# EAGLE schematic adc (EAGLE 6.1)
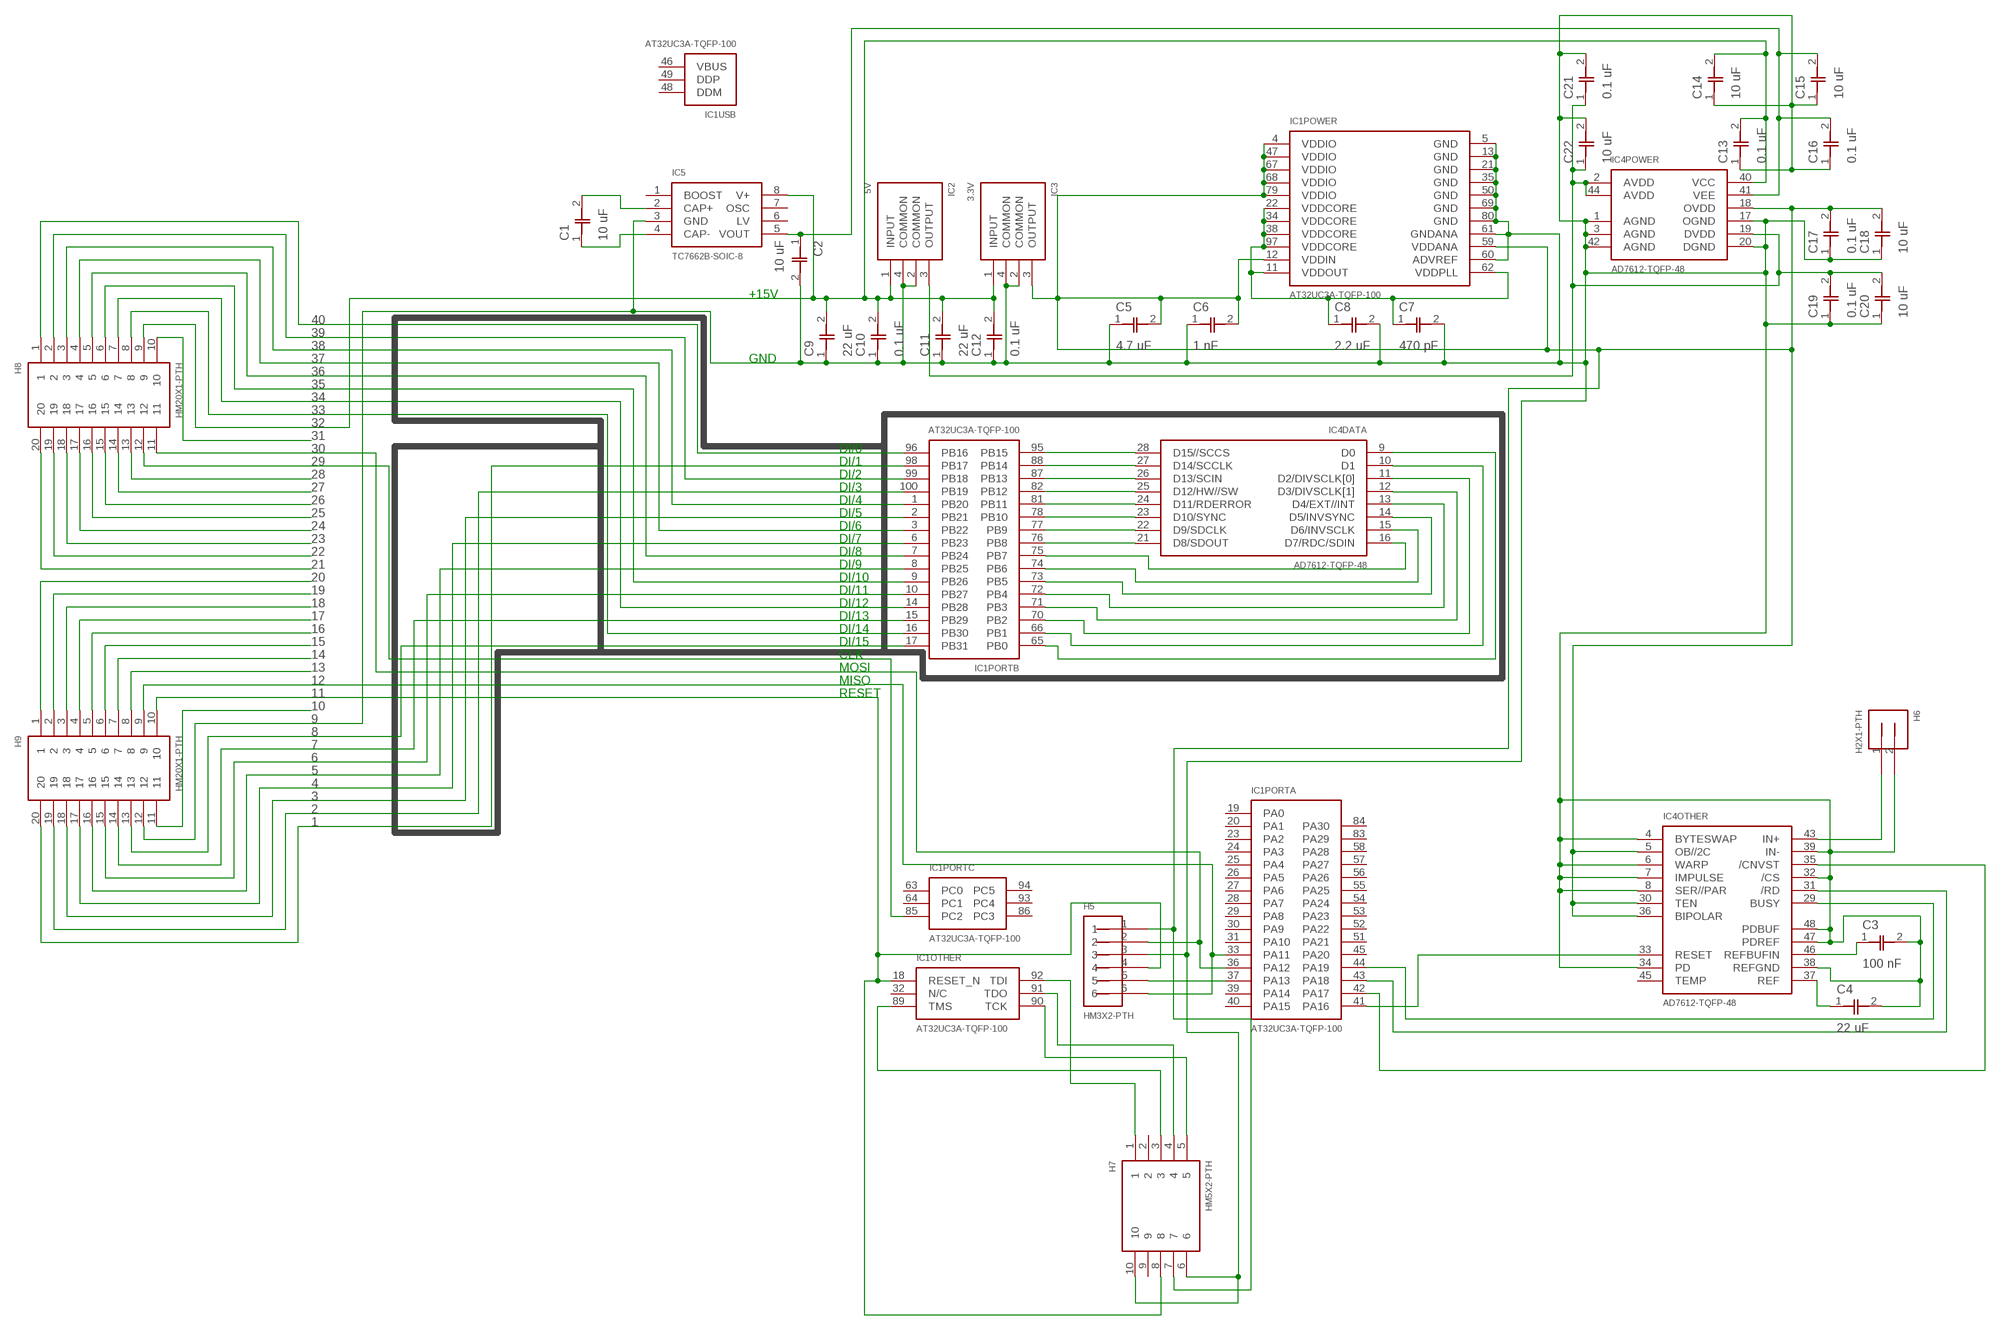
[diagram p0: schematic, sheet 1]

## Parts
C1  10 uF  CAP-0805  [CAP-0805]
C2  10 uF  CAP-0805  [CAP-0805]
C3  100 nF  CAP-0603  [CAP-0603]
C4  22 uF  CAP-0805  [CAP-0805]
C5  4.7 uF  CAP-0603  [CAP-0603]
C6  1 nF  CAP-0603  [CAP-0603]
C7  470 pF  CAP-0603  [CAP-0603]
C8  2.2 uF  CAP-0603  [CAP-0603]
C9  22 uF  CAP-0805  [CAP-0805]
C10  0.1 uF  CAP-0603  [CAP-0603]
C11  22 uF  CAP-0805  [CAP-0805]
C12  0.1 uF  CAP-0603  [CAP-0603]
C13  0.1 uF  CAP-0603  [CAP-0603]
C14  10 uF  CAP-0805  [CAP-0805]
C15  10 uF  CAP-0805  [CAP-0805]
C16  0.1 uF  CAP-0603  [CAP-0603]
C17  0.1 uF  CAP-0603  [CAP-0603]
C18  10 uF  CAP-0603  [CAP-0603]
C19  0.1 uF  CAP-0603  [CAP-0603]
C20  10 uF  CAP-0603  [CAP-0603]
C21  0.1 uF  CAP-0603  [CAP-0603]
C22  10 uF  CAP-0603  [CAP-0603]
H5  HM3X2-PTH  [HM3X2-PTH]
H6  H2X1-PTH  [HM2X1-PTH]
H7  HM5X2-PTH  [HM5X2-PTH]
H8  HM20X1-PTH  [HM20X1-PTH]
H9  HM20X1-PTH  [HM20X1-PTH]
IC1  AT32UC3A-TQFP-100  [TQFP-100]
IC2  5V  UA78M-SOT-223-4  [SOT-223-4]
IC3  3.3V  UA78M-SOT-223-4  [SOT-223-4]
IC4  AD7612-TQFP-48  [LQFP-48]
IC5  TC7662B-SOIC-8  [SOIC-8]

## Nets
1: H9.20 IC1.98(PORTB:PB17)
1.8V: C7.1 C8.1 IC1.11(POWER:VDDOUT) IC1.22(POWER:VDDCORE) IC1.34(POWER:VDDCORE) IC1.38(POWER:VDDCORE) IC1.62(POWER:VDDPLL) IC1.97(POWER:VDDCORE)
2: H9.19 IC1.100(PORTB:PB19)
3: H9.18 IC1.2(PORTB:PB21)
3.3V: C5.2 C6.2 C17.2 C18.2 H5.1 H7.7 IC1.4(POWER:VDDIO) IC1.12(POWER:VDDIN) IC1.47(POWER:VDDIO) IC1.59(POWER:VDDANA) IC1.67(POWER:VDDIO) IC1.68(POWER:VDDIO) IC1.79(POWER:VDDIO) IC3.3(OUTPUT) IC4.5(OTHER:OB//2C) IC4.18(POWER:OVDD) IC4.30(OTHER:TEN) IC4.36(OTHER:BIPOLAR)
4: H9.17 IC1.6(PORTB:PB23)
5: H9.16 IC1.8(PORTB:PB25)
5V: C19.2 C20.2 C21.1 C22.1 IC2.3(OUTPUT) IC4.2(POWER:AVDD) IC4.19(POWER:DVDD) IC4.44(POWER:AVDD)
6: H9.15 IC1.10(PORTB:PB27)
7: H9.14 IC1.15(PORTB:PB29)
8: H9.13 IC1.17(PORTB:PB31)
9: C2.2 C3.2 C4.2 C5.1 C6.1 C7.2 C8.2 C9.1 C10.1 C11.1 C12.1 C13.1 C14.1 C15.1 C16.1 C17.1 C18.1 C19.1 C20.1 C21.2 C22.2 H5.3 H6.2 H7.6 H7.10 H9.12 IC1.5(POWER:GND) IC1.13(POWER:GND) IC1.21(POWER:GND) IC1.35(POWER:GND) IC1.50(POWER:GND) IC1.60(POWER:ADVREF) IC1.61(POWER:GNDANA) IC1.69(POWER:GND) IC1.80(POWER:GND) IC2.2(COMMON) IC2.4(COMMON) IC3.2(COMMON) IC3.4(COMMON) IC4.1(POWER:AGND) IC4.3(POWER:AGND) IC4.4(OTHER:BYTESWAP) IC4.6(OTHER:WARP) IC4.7(OTHER:IMPULSE) IC4.8(OTHER:SER//PAR) IC4.17(POWER:OGND) IC4.20(POWER:DGND) IC4.32(OTHER:/CS) IC4.34(OTHER:PD) IC4.38(OTHER:REFGND) IC4.39(OTHER:IN-) IC4.42(POWER:AGND) IC4.47(OTHER:PDREF) IC4.48(OTHER:PDBUF) IC5.3(GND)
10: H9.11
11: H5.4 H7.8 H9.10 IC1.18(OTHER:RESET_N)
12: H5.6 H9.9 IC1.33(PORTA:PA11)
13: H9.8
14: H9.7
15: H9.6
16: H9.5
17: H9.4
18: H9.3
19: H9.2
20: H9.1
21: H8.20
22: H8.19
23: H8.18
24: H8.17
25: H8.16
26: H8.15
27: H8.14
28: H8.13
29: H8.12 IC1.85(PORTC:PC2)
30: H5.2 H8.11 IC1.36(PORTA:PA12)
31: H8.10
32: C9.2 C10.2 C11.2 C12.2 C13.2 C14.2 H8.9 IC2.1(INPUT) IC3.1(INPUT) IC4.40(POWER:VCC) IC5.8(V+)
33: H8.8 IC1.16(PORTB:PB30)
34: H8.7 IC1.14(PORTB:PB28)
35: H8.6 IC1.9(PORTB:PB26)
36: H8.5 IC1.7(PORTB:PB24)
37: H8.4 IC1.3(PORTB:PB22)
38: H8.3 IC1.1(PORTB:PB20)
39: H8.2 IC1.99(PORTB:PB18)
40: H8.1 IC1.96(PORTB:PB16)
-15V: C2.1 C15.2 C16.2 IC4.41(POWER:VEE) IC5.5(VOUT)
N$1: H5.5 IC1.37(PORTA:PA13)
N$2: C1.2 IC5.2(CAP+)
N$4: IC1.65(PORTB:PB0) IC4.9(DATA:D0)
N$5: IC1.66(PORTB:PB1) IC4.10(DATA:D1)
N$6: IC1.70(PORTB:PB2) IC4.11(DATA:D2/DIVSCLK[0])
N$7: IC1.71(PORTB:PB3) IC4.12(DATA:D3/DIVSCLK[1])
N$8: C1.1 IC5.4(CAP-)
N$9: IC1.72(PORTB:PB4) IC4.13(DATA:D4/EXT//INT)
N$10: IC1.73(PORTB:PB5) IC4.14(DATA:D5/INVSYNC)
N$11: IC1.74(PORTB:PB6) IC4.15(DATA:D6/INVSCLK)
N$12: IC1.76(PORTB:PB8) IC4.21(DATA:D8/SDOUT)
N$13: IC1.77(PORTB:PB9) IC4.22(DATA:D9/SDCLK)
N$14: IC1.78(PORTB:PB10) IC4.23(DATA:D10/SYNC)
N$15: IC1.81(PORTB:PB11) IC4.24(DATA:D11/RDERROR)
N$16: IC1.82(PORTB:PB12) IC4.25(DATA:D12/HW//SW)
N$17: IC1.87(PORTB:PB13) IC4.26(DATA:D13/SCIN)
N$18: IC1.88(PORTB:PB14) IC4.27(DATA:D14/SCCLK)
N$19: IC1.95(PORTB:PB15) IC4.28(DATA:D15//SCCS)
N$20: IC1.75(PORTB:PB7) IC4.16(DATA:D7/RDC/SDIN)
N$22: IC1.41(PORTA:PA16) IC4.33(OTHER:RESET)
N$23: IC1.44(PORTA:PA19) IC4.29(OTHER:BUSY)
N$24: IC1.42(PORTA:PA17) IC4.35(OTHER:/CNVST)
N$25: C3.1 IC4.46(OTHER:REFBUFIN)
N$26: C4.1 IC4.37(OTHER:REF)
N$27: IC1.43(PORTA:PA18) IC4.31(OTHER:/RD)
N$28: H6.1 IC4.43(OTHER:IN+)
N$29: H7.5 IC1.90(OTHER:TCK)
N$30: H7.4 IC1.91(OTHER:TDO)
N$31: H7.3 IC1.89(OTHER:TMS)
N$32: H7.1 IC1.92(OTHER:TDI)
Unconnected: H7.2 H7.9 IC1.19(PORTA:PA0) IC1.20(PORTA:PA1) IC1.23(PORTA:PA2) IC1.24(PORTA:PA3) IC1.25(PORTA:PA4) IC1.26(PORTA:PA5) IC1.27(PORTA:PA6) IC1.28(PORTA:PA7) IC1.29(PORTA:PA8) IC1.30(PORTA:PA9) IC1.31(PORTA:PA10) IC1.32(OTHER:N/C) IC1.39(PORTA:PA14) IC1.40(PORTA:PA15) IC1.45(PORTA:PA20) IC1.46(USB:VBUS) IC1.48(USB:DDM) IC1.49(USB:DDP) IC1.51(PORTA:PA21) IC1.52(PORTA:PA22) IC1.53(PORTA:PA23) IC1.54(PORTA:PA24) IC1.55(PORTA:PA25) IC1.56(PORTA:PA26) IC1.57(PORTA:PA27) IC1.58(PORTA:PA28) IC1.63(PORTC:PC0) IC1.64(PORTC:PC1) IC1.83(PORTA:PA29) IC1.84(PORTA:PA30) IC1.86(PORTC:PC3) IC1.93(PORTC:PC4) IC1.94(PORTC:PC5) IC4.45(OTHER:TEMP) IC5.1(BOOST) IC5.6(LV) IC5.7(OSC)

## Notes on the sheet
- +15V
- GND
- DI/0
- DI/1
- DI/2
- DI/3
- DI/4
- DI/5
- DI/6
- DI/7
- DI/8
- DI/9
- DI/10
- DI/11
- DI/12
- DI/13
- DI/14
- DI/15
- CLK
- MOSI
- MISO
- RESET

## Library data of the parts
C1 C2 C4 C9 C11 C14 C15 = august24:CAP
C3 C5-C8 C10 C12 C13 C16-C22 = july13b:CAP
H5 = august24:HM3X2
H6 = august24:H2X1
H7 = august24:HM5X2
H8 H9 = august24:HM20X1
IC1 = july13b:AT32UC3A
IC2 IC3 = july13b:UA78M*
IC4 = july13b:AD7612
IC5 = july13b:TC7662B